# EAGLE board A500_GRAKA_26 (EAGLE 6.6.0), part 1 of 2
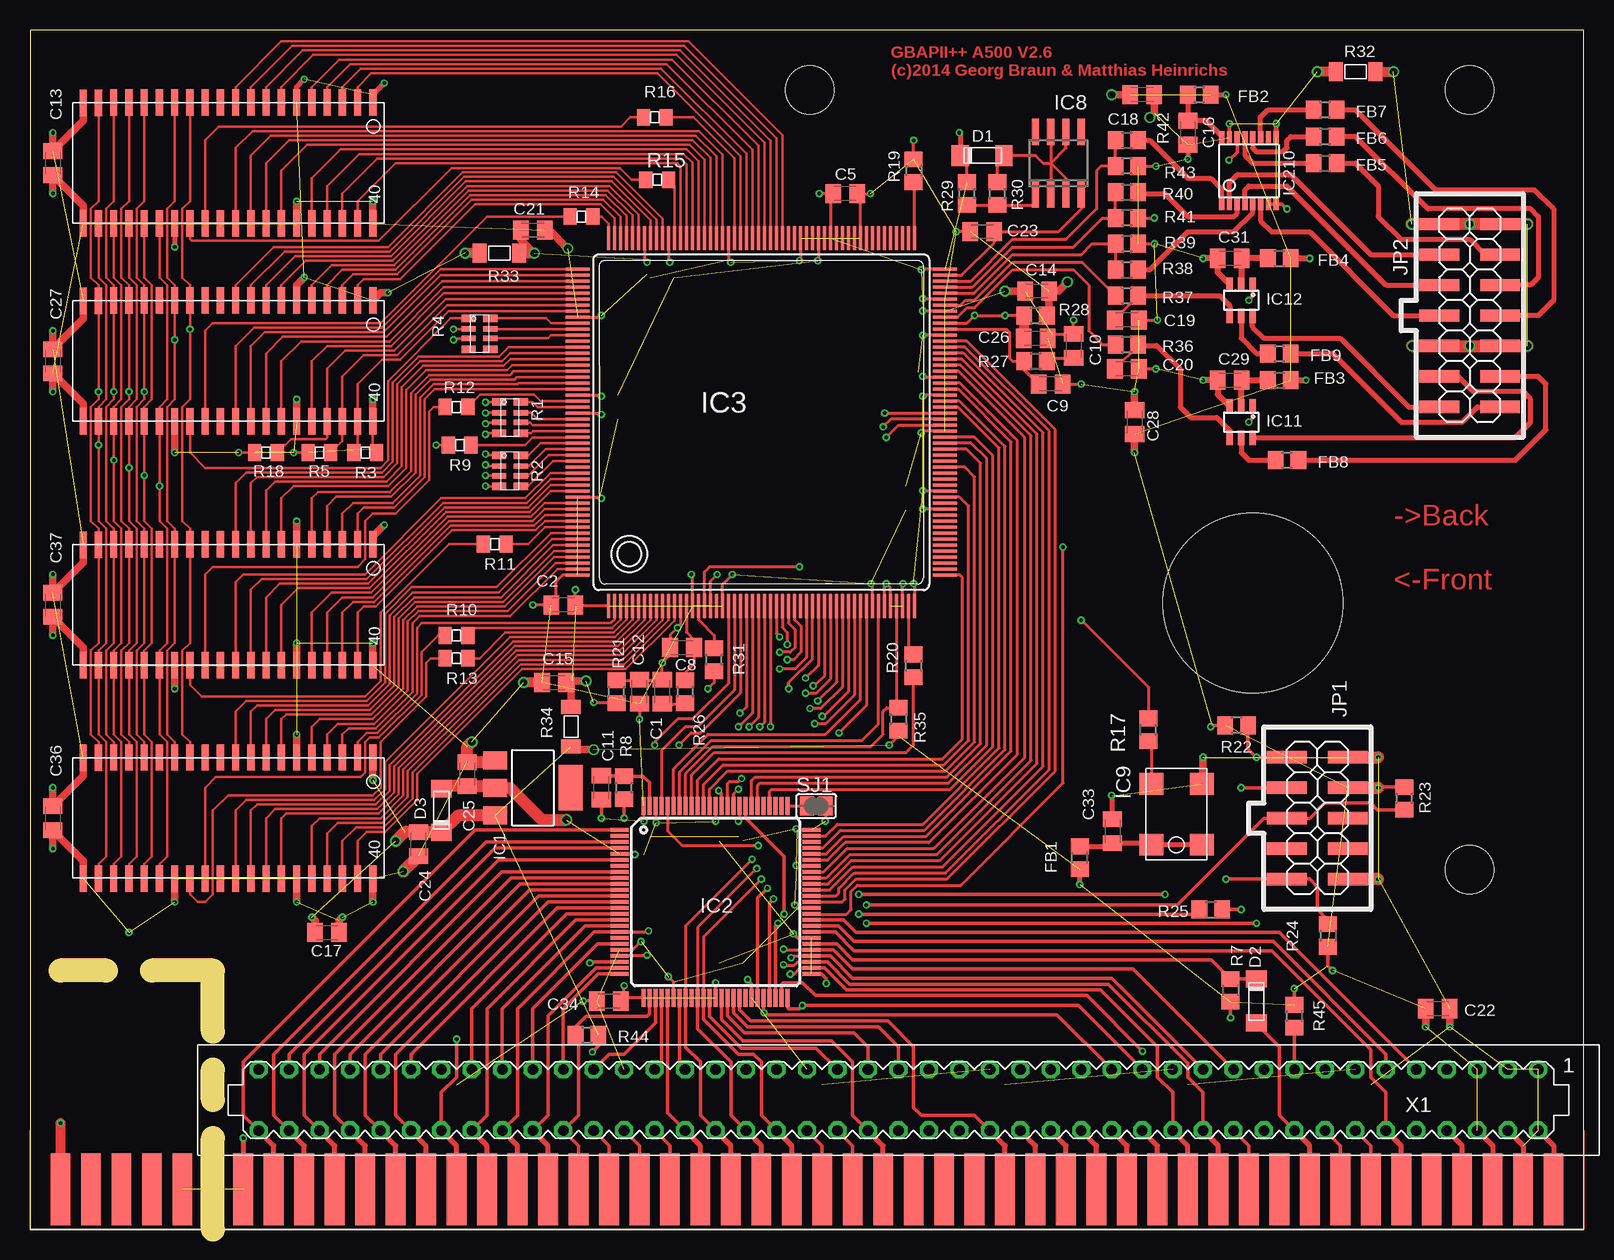
[diagram p2: board, top side]
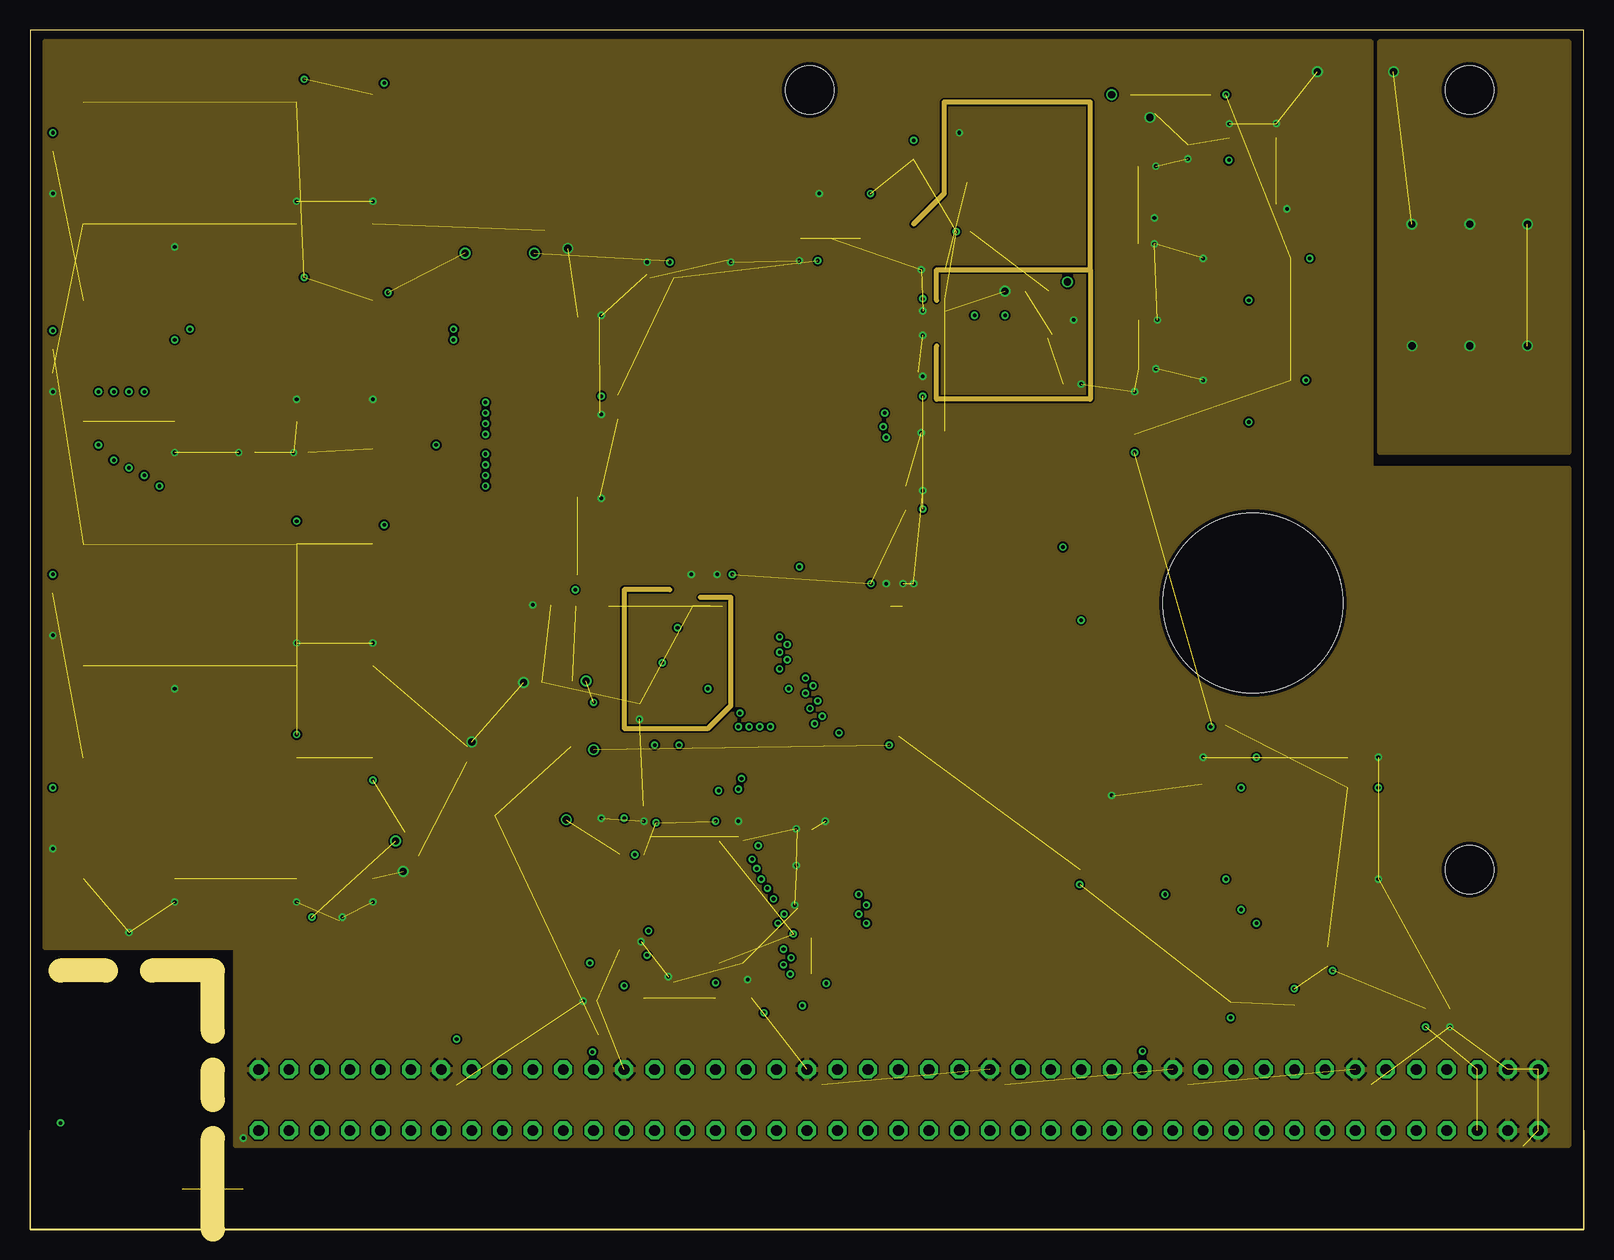
[diagram p3: board, inner layer Route2]
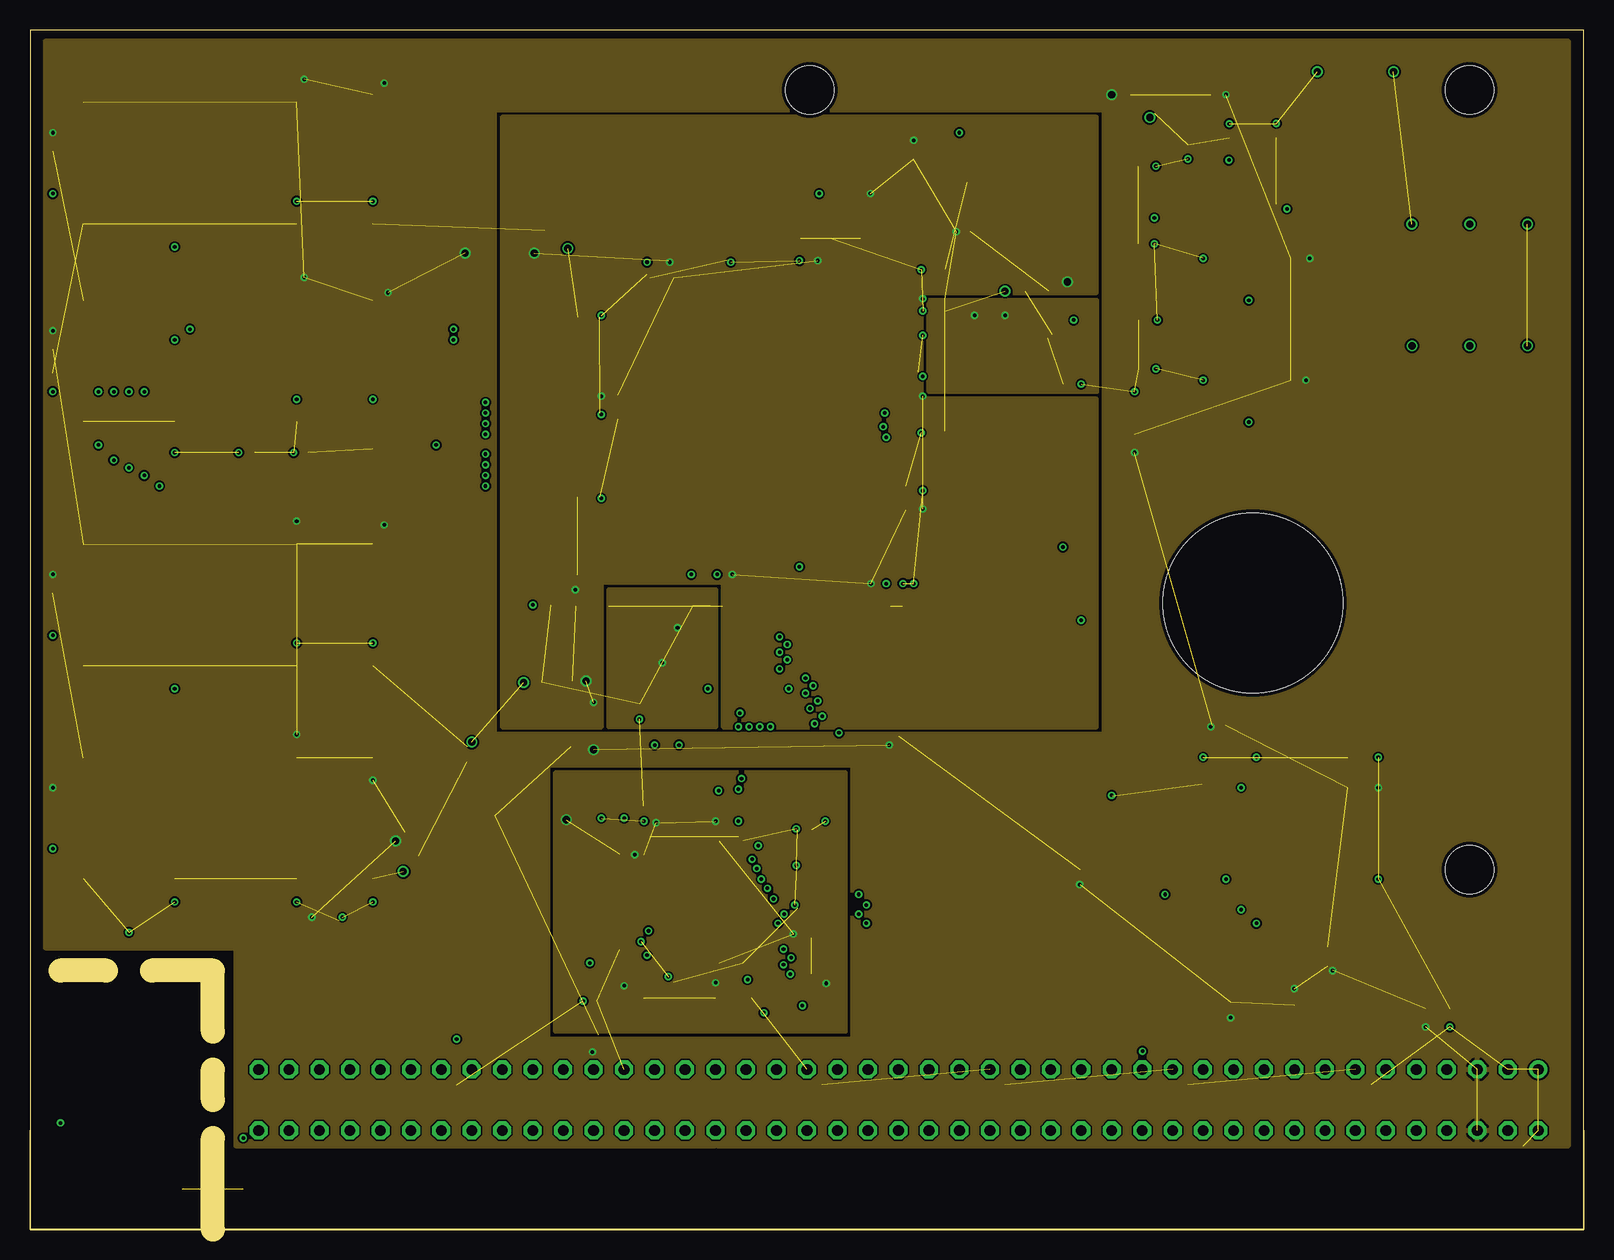
[diagram p4: board, inner layer Route15]
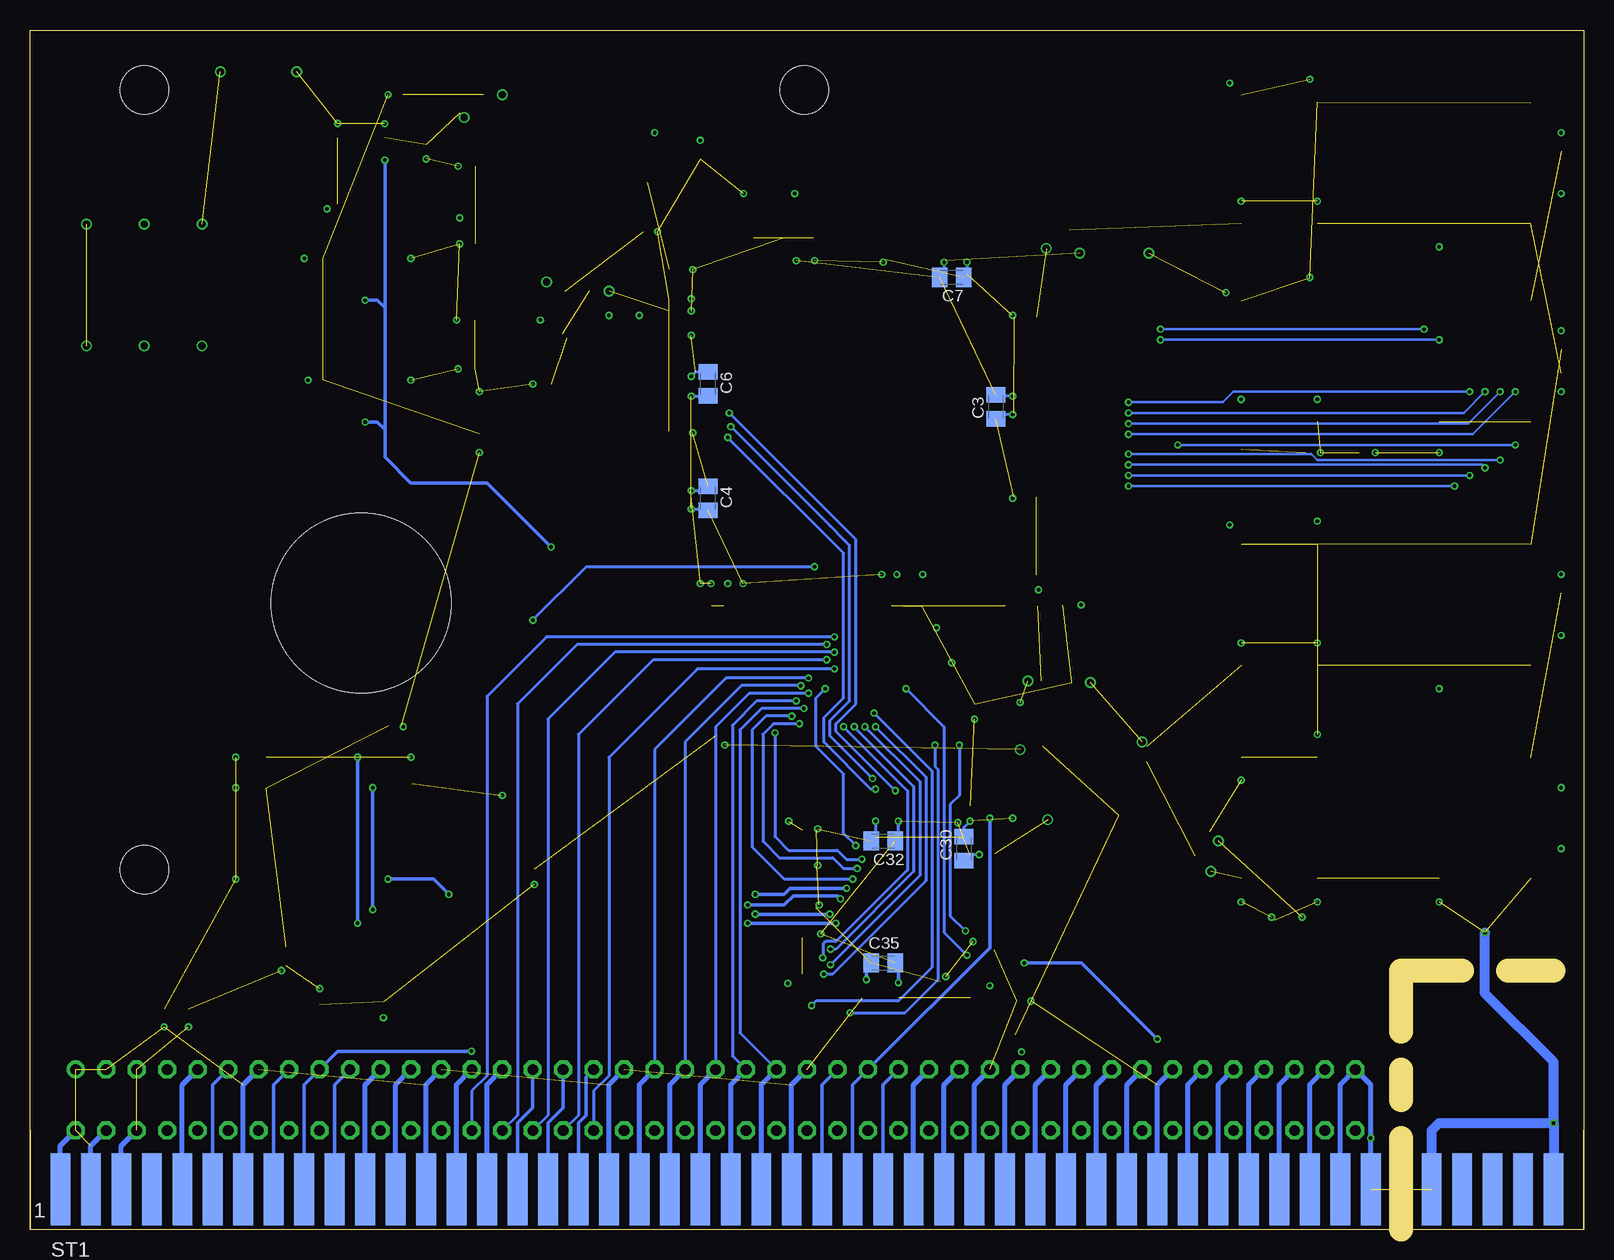
[diagram p5: board, bottom side, seen from below]

Size 129.54 x 100 mm. Coordinates in mm from the lower left corner, seen from the top.
Outline: 0,0 129.52,0 129.52,24.13 129.54,24.13 129.52,100 0,100 0,0
Copper layers (1+2*15+16): Top 0.035mm / dielectric 0.36mm / Route2 0.035mm / dielectric 0.71mm / Route15 0.035mm / dielectric 0.36mm / Bottom 0.035mm
Design rules "LeitOn - Standard-Eagle-DRU - 4-Lagen Multilayer - deutsch - Rev 2.0": minimum track width 0.15mm, minimum drill 0.3mm, track to track 0.15mm, track to pad 0.15mm, pad to pad 0.15mm, via to via 0.15mm, smd to smd 0.15mm, copper to edge 0.3mm, drill to drill 0.3mm, minimum pad ring 0.15mm, minimum via ring 0.15mm, stop-mask expansion 0.075mm, vias tented up to drill 0mil, thermal gap 0.2mm
Holes 4 mm at 120,30 65,95 120,95
Holes 15 mm at 101.93,52.22
tRestrict: area 61,91 to 69,99; area 116,91 to 124,99; area 116,26 to 124,34
bRestrict: area 61,91 to 69,99; area 116,91 to 124,99; area 116,26 to 124,34
Milling: 5 lines

## Footprints (pad centres in the part's own frame; a part is rotated, then mirrored left to right if it is on the bottom)
C0805K = smd 1.3 x 1.6: 1 -1,0; 2 1,0
SOD-80 = smd 1.429 x 1.746: 1 1.826,-0.002; 2 -1.832,0
R0805 = smd 1.3 x 1.5: 1 -0.95,0; 2 0.95,0
SOT223 = smd 1.499 x 2.007: 1 -2.261,-3.15; 2 0.025,-3.15; 3 2.311,-3.15 | smd 3.81 x 2.007: 4 0,3.15
TQ100 = smd 1.524 x 0.343: 1 -4.19,3.46; 2 -4.19,2.96; 3 -4.19,2.46; 4 -4.19,1.96; 5 -4.19,1.46; 6 -4.19,0.96; 7 -4.19,0.46; 8 -4.19,-0.04; 9 -4.19,-0.54; 10 -4.19,-1.04; 11 -4.19,-1.54; 13 -4.19,-2.54; 14 -4.19,-3.04; 15 -4.19,-3.54; 16 -4.19,-4.04; 17 -4.19,-4.54; 18 -4.19,-5.04; 19 -4.19,-5.54; 20 -4.19,-6.04; 21 -4.19,-6.54; 22 -4.19,-7.04; 23 -4.19,-7.54; 24 -4.19,-8.04; 25 -4.19,-8.54; 51 11.81,-8.54; 52 11.81,-8.04; 53 11.81,-7.54; 54 11.81,-7.04; 55 11.81,-6.54; 56 11.81,-6.04; 57 11.81,-5.54; 58 11.81,-5.04; 59 11.81,-4.54; 60 11.81,-4.04; 61 11.81,-3.54; 62 11.81,-3.04; 63 11.81,-2.54; 64 11.81,-2.04; 65 11.81,-1.54; 66 11.81,-1.04; 67 11.81,-0.54; 68 11.81,-0.04; 69 11.81,0.46; 70 11.81,0.96; 71 11.81,1.46; 72 11.81,1.96; 73 11.81,2.46; 74 11.81,2.96; 75 11.81,3.46 | smd 1.5 x 0.35: 12 -4.19,-2.04 | smd 0.343 x 1.524: 26 -2.19,-10.54; 27 -1.69,-10.54; 28 -1.19,-10.54; 29 -0.69,-10.54; 30 -0.19,-10.54; 31 0.31,-10.54; 32 0.81,-10.54; 33 1.31,-10.54; 34 1.81,-10.54; 35 2.31,-10.54; 36 2.81,-10.54; 37 3.31,-10.54; 38 3.81,-10.54; 39 4.31,-10.54; 40 4.81,-10.54; 41 5.31,-10.54; 42 5.81,-10.54; 43 6.31,-10.54; 44 6.81,-10.54; 45 7.31,-10.54; 46 7.81,-10.54; 47 8.31,-10.54; 48 8.81,-10.54; 49 9.31,-10.54; 50 9.81,-10.54; 76 9.81,5.46; 77 9.31,5.46; 78 8.81,5.46; 79 8.31,5.46; 80 7.81,5.46; 81 7.31,5.46; 82 6.81,5.46; 83 6.31,5.46; 84 5.81,5.46; 85 5.31,5.46; 86 4.81,5.46; 87 4.31,5.46; 88 3.81,5.46; 89 3.31,5.46; 90 2.81,5.46; 91 2.31,5.46; 92 1.81,5.46; 93 1.31,5.46; 94 0.81,5.46; 95 0.31,5.46; 96 -0.19,5.46; 97 -0.69,5.46; 98 -1.19,5.46; 99 -1.69,5.46; 100 -2.19,5.46
PQFP-208@3 = smd 0.25 x 2: 1 -12.75,-15.326; 2 -12.25,-15.326; 3 -11.75,-15.326; 4 -11.25,-15.326; 5 -10.75,-15.326; 6 -10.25,-15.326; 7 -9.75,-15.326; 8 -9.25,-15.326; 9 -8.75,-15.326; 10 -8.25,-15.326; 11 -7.75,-15.326; 12 -7.25,-15.326; 13 -6.75,-15.326; 14 -6.25,-15.326; 15 -5.75,-15.326; 16 -5.25,-15.326; 17 -4.75,-15.326; 18 -4.25,-15.326; 19 -3.75,-15.326; 20 -3.25,-15.326; 21 -2.75,-15.326; 22 -2.25,-15.326; 23 -1.75,-15.326; 24 -1.25,-15.326; 25 -0.75,-15.326; 26 -0.25,-15.326; 27 0.25,-15.326; 28 0.75,-15.326; 29 1.25,-15.326; 30 1.75,-15.326; 31 2.25,-15.326; 32 2.75,-15.326; 33 3.25,-15.326; 34 3.75,-15.326; 35 4.25,-15.326; 36 4.75,-15.326; 37 5.25,-15.326; 38 5.75,-15.326; 39 6.25,-15.326; 40 6.75,-15.326; 41 7.25,-15.326; 42 7.75,-15.326; 43 8.25,-15.326; 44 8.75,-15.326; 45 9.25,-15.326; 46 9.75,-15.326; 47 10.25,-15.326; 48 10.75,-15.326; 49 11.25,-15.326; 50 11.75,-15.326; 51 12.25,-15.326; 52 12.75,-15.326; 105 12.75,15.326; 106 12.25,15.326; 107 11.75,15.326; 108 11.25,15.326; 109 10.75,15.326; 110 10.25,15.326; 111 9.75,15.326; 112 9.25,15.326; 113 8.75,15.326; 114 8.25,15.326; 115 7.75,15.326; 116 7.25,15.326; 117 6.75,15.326; 118 6.25,15.326; 119 5.75,15.326; 120 5.25,15.326; 121 4.75,15.326; 122 4.25,15.326; 123 3.75,15.326; 124 3.25,15.326; 125 2.75,15.326; 126 2.25,15.326; 127 1.75,15.326; 128 1.25,15.326; 129 0.75,15.326; 130 0.25,15.326; 131 -0.25,15.326; 132 -0.75,15.326; 133 -1.25,15.326; 134 -1.75,15.326; 135 -2.25,15.326; 136 -2.75,15.326; 137 -3.25,15.326; 138 -3.75,15.326; 139 -4.25,15.326; 140 -4.75,15.326; 141 -5.25,15.326; 142 -5.75,15.326; 143 -6.25,15.326; 144 -6.75,15.326; 145 -7.25,15.326; 146 -7.75,15.326; 147 -8.25,15.326; 148 -8.75,15.326; 149 -9.25,15.326; 150 -9.75,15.326; 151 -10.25,15.326; 152 -10.75,15.326; 153 -11.25,15.326; 154 -11.75,15.326; 155 -12.25,15.326; 156 -12.75,15.326 | smd 2 x 0.25: 53 15.326,-12.75; 54 15.326,-12.25; 55 15.326,-11.75; 56 15.326,-11.25; 57 15.326,-10.75; 58 15.326,-10.25; 59 15.326,-9.75; 60 15.326,-9.25; 61 15.326,-8.75; 62 15.326,-8.25; 63 15.326,-7.75; 64 15.326,-7.25; 65 15.326,-6.75; 66 15.326,-6.25; 67 15.326,-5.75; 68 15.326,-5.25; 69 15.326,-4.75; 70 15.326,-4.25; 71 15.326,-3.75; 72 15.326,-3.25; 73 15.326,-2.75; 74 15.326,-2.25; 75 15.326,-1.75; 76 15.326,-1.25; 77 15.326,-0.75; 78 15.326,-0.25; 79 15.326,0.25; 80 15.326,0.75; 81 15.326,1.25; 82 15.326,1.75; 83 15.326,2.25; 84 15.326,2.75; 85 15.326,3.25; 86 15.326,3.75; 87 15.326,4.25; 88 15.326,4.75; 89 15.326,5.25; 90 15.326,5.75; 91 15.326,6.25; 92 15.326,6.75; 93 15.326,7.25; 94 15.326,7.75; 95 15.326,8.25; 96 15.326,8.75; 97 15.326,9.25; 98 15.326,9.75; 99 15.326,10.25; 100 15.326,10.75; 101 15.326,11.25; 102 15.326,11.75; 103 15.326,12.25; 104 15.326,12.75; 157 -15.326,12.75; 158 -15.326,12.25; 159 -15.326,11.75; 160 -15.326,11.25; 161 -15.326,10.75; 162 -15.326,10.25; 163 -15.326,9.75; 164 -15.326,9.25; 165 -15.326,8.75; 166 -15.326,8.25; 167 -15.326,7.75; 168 -15.326,7.25; 169 -15.326,6.75; 170 -15.326,6.25; 171 -15.326,5.75; 172 -15.326,5.25; 173 -15.326,4.75; 174 -15.326,4.25; 175 -15.326,3.75; 176 -15.326,3.25; 177 -15.326,2.75; 178 -15.326,2.25; 179 -15.326,1.75; 180 -15.326,1.25; 181 -15.326,0.75; 182 -15.326,0.25; 183 -15.326,-0.25; 184 -15.326,-0.75; 185 -15.326,-1.25; 186 -15.326,-1.75; 187 -15.326,-2.25; 188 -15.326,-2.75; 189 -15.326,-3.25; 190 -15.326,-3.75; 191 -15.326,-4.25; 192 -15.326,-4.75; 193 -15.326,-5.25; 194 -15.326,-5.75; 195 -15.326,-6.25; 196 -15.326,-6.75; 197 -15.326,-7.25; 198 -15.326,-7.75; 199 -15.326,-8.25; 200 -15.326,-8.75; 201 -15.326,-9.25; 202 -15.326,-9.75; 203 -15.326,-10.25; 204 -15.326,-10.75; 205 -15.326,-11.25; 206 -15.326,-11.75; 207 -15.326,-12.25; 208 -15.326,-12.75
SOJ40/4 = smd 0.6 x 2.2: 1 -10.795,-5.061; 2 -9.525,-5.061; 3 -8.255,-5.061; 4 -6.985,-5.061; 5 -5.715,-5.061; 6 -4.445,-5.061; 7 -3.175,-5.061; 8 -1.905,-5.061; 9 -0.635,-5.061; 10 0.635,-5.061; 11 1.905,-5.061; 12 3.175,-5.061; 13 4.445,-5.061; 14 5.715,-5.061; 15 6.985,-5.061; 16 8.255,-5.061; 17 9.525,-5.061; 18 10.795,-5.061; 19 12.065,-5.029; 20 13.335,-5.029; 21 13.335,5.029; 22 12.065,5.029; 23 10.795,5.029; 24 9.525,5.029; 25 8.255,5.029; 26 6.985,5.029; 27 5.715,5.029; 28 4.445,5.029; 29 3.175,5.029; 30 1.905,5.029; 31 0.635,5.029; 32 -0.635,5.029; 33 -1.905,5.029; 34 -3.175,5.029; 35 -4.445,5.029; 36 -5.715,5.029; 37 -6.985,5.029; 38 -8.255,5.029; 39 -9.525,5.029; 40 -10.795,5.029
SO08 = smd 0.6 x 2.2: 1 -1.905,-2.6; 2 -0.635,-2.6; 3 0.635,-2.6; 4 1.905,-2.6; 5 1.905,2.6; 6 0.635,2.6; 7 -0.635,2.6; 8 -1.905,2.6
7X5 = smd 1.8 x 2: P$1 -2.54,-2.1; P$2 2.54,-2.1; P$3 2.54,2.1; P$4 -2.54,2.1
SOT23-6L = smd 0.55 x 1.2: 1 -0.95,-1.3; 2 0,-1.3; 3 0.95,-1.3; 4 0.95,1.3; 5 0,1.3; 6 -0.95,1.3
TSSOP16 = smd 0.45 x 1.05: 1 -2.275,-2.768; 2 -1.625,-2.768; 3 -0.975,-2.768; 4 -0.325,-2.768; 5 0.325,-2.768; 6 0.975,-2.768; 7 1.625,-2.768; 8 2.275,-2.768; 9 2.275,2.768; 10 1.625,2.768; 11 0.975,2.768; 12 0.325,2.768; 13 -0.325,2.768; 14 -0.975,2.768; 15 -1.625,2.768; 16 -2.275,2.768
2X05SMD = smd 1.016 x 3.302: 1 -1.27,-3.81; 2 -1.27,1.27; 3 1.27,-3.81; 4 1.27,1.27; 5 3.81,-3.81; 6 3.81,1.27; 7 6.35,-3.81; 8 6.35,1.27; 9 8.89,-3.81; 10 8.89,1.27
2X07SMD = smd 1.016 x 3.302: 1 -1.27,-3.81; 2 -1.27,1.27; 3 1.27,-3.81; 4 1.27,1.27; 5 3.81,-3.81; 6 3.81,1.27; 7 6.35,-3.81; 8 6.35,1.27; 9 8.89,-3.81; 10 8.89,1.27; 11 11.43,-3.81; 12 11.43,1.27; 13 13.97,-3.81; 14 13.97,1.27
R-NETZ = smd 0.63 x 1.2: P$1 -1.3,-0.9; P$4 1.3,-0.9; P$5 1.3,0.9; P$8 -1.3,0.9 | smd 0.45 x 1.2: P$2 -0.4,-0.9; P$3 0.4,-0.9; P$6 0.4,0.9; P$7 -0.4,0.9
0805@2 = smd 1.092 x 1.397: 1 -0.94,0; 2 0.94,0
0204 = smd 1.16 x 1.6: 1 -1.651,0; 2 1.651,0
SJ = smd 1.168 x 1.6: 1 -0.762,0; 2 0.762,0
LKOT-501 = smd 1.65 x 6: 1 -62.23,-0.953; 3 -59.69,-0.953; 5 -57.15,-0.953; 7 -54.61,-0.953; 9 -52.07,-0.953; 11 -49.53,-0.953; 13 -46.99,-0.953; 15 -44.45,-0.953; 17 -41.91,-0.953; 19 -39.37,-0.953; 21 -36.83,-0.953; 23 -34.29,-0.953; 25 -31.75,-0.953; 27 -29.21,-0.953; 29 -26.67,-0.953; 31 -24.13,-0.953; 33 -21.59,-0.953; 35 -19.05,-0.953; 37 -16.51,-0.953; 39 -13.97,-0.953; 41 -11.43,-0.953; 43 -8.89,-0.953; 45 -6.35,-0.953; 47 -3.81,-0.953; 49 -1.27,-0.953; 51 1.27,-0.953; 53 3.81,-0.953; 55 6.35,-0.953; 57 8.89,-0.953; 59 11.43,-0.953; 61 13.97,-0.953; 63 16.51,-0.953; 65 19.05,-0.953; 67 21.59,-0.953; 69 24.13,-0.953; 71 26.67,-0.953; 73 29.21,-0.953; 75 31.75,-0.953; 77 34.29,-0.953; 79 36.83,-0.953; 81 39.37,-0.953; 83 41.91,-0.953; 85 44.45,-0.953; 87 46.99,-0.953; 89 49.53,-0.953; 91 52.07,-0.953; 93 54.61,-0.953; 95 57.15,-0.953; 97 59.69,-0.953; 99 62.23,-0.953 | smd 1.65 x 6 bottom: 2 -62.23,-0.953; 4 -59.69,-0.953; 6 -57.15,-0.953; 8 -54.61,-0.953; 10 -52.07,-0.953; 12 -49.53,-0.953; 14 -46.99,-0.953; 16 -44.45,-0.953; 18 -41.91,-0.953; 20 -39.37,-0.953; 22 -36.83,-0.953; 24 -34.29,-0.953; 26 -31.75,-0.953; 28 -29.21,-0.953; 30 -26.67,-0.953; 32 -24.13,-0.953; 34 -21.59,-0.953; 36 -19.05,-0.953; 38 -16.51,-0.953; 40 -13.97,-0.953; 42 -11.43,-0.953; 44 -8.89,-0.953; 46 -6.35,-0.953; 48 -3.81,-0.953; 50 -1.27,-0.953; 52 1.27,-0.953; 54 3.81,-0.953; 56 6.35,-0.953; 58 8.89,-0.953; 60 11.43,-0.953; 62 13.97,-0.953; 64 16.51,-0.953; 66 19.05,-0.953; 68 21.59,-0.953; 70 24.13,-0.953; 72 26.67,-0.953; 74 29.21,-0.953; 76 31.75,-0.953; 78 34.29,-0.953; 80 36.83,-0.953; 82 39.37,-0.953; 84 41.91,-0.953; 86 44.45,-0.953; 88 46.99,-0.953; 90 49.53,-0.953; 92 52.07,-0.953; 94 54.61,-0.953; 96 57.15,-0.953; 98 59.69,-0.953; 100 62.23,-0.953
SLOT-86 = drill 0.9 pad 1.5: 1 -53.34,-2.54 | drill 0.9 pad 1.5 octagon: 2 -53.34,2.54; 3 -50.8,-2.54; 4 -50.8,2.54; 5 -48.26,-2.54; 6 -48.26,2.54; 7 -45.72,-2.54; 8 -45.72,2.54; 9 -43.18,-2.54; 10 -43.18,2.54; 11 -40.64,-2.54; 12 -40.64,2.54; 13 -38.1,-2.54; 14 -38.1,2.54; 15 -35.56,-2.54; 16 -35.56,2.54; 17 -33.02,-2.54; 18 -33.02,2.54; 19 -30.48,-2.54; 20 -30.48,2.54; 21 -27.94,-2.54; 22 -27.94,2.54; 23 -25.4,-2.54; 24 -25.4,2.54; 25 -22.86,-2.54; 26 -22.86,2.54; 27 -20.32,-2.54; 28 -20.32,2.54; 29 -17.78,-2.54; 30 -17.78,2.54; 31 -15.24,-2.54; 32 -15.24,2.54; 33 -12.7,-2.54; 34 -12.7,2.54; 35 -10.16,-2.54; 36 -10.16,2.54; 37 -7.62,-2.54; 38 -7.62,2.54; 39 -5.08,-2.54; 40 -5.08,2.54; 41 -2.54,-2.54; 42 -2.54,2.54; 43 0,-2.54; 44 0,2.54; 45 2.54,-2.54; 46 2.54,2.54; 47 5.08,-2.54; 48 5.08,2.54; 49 7.62,-2.54; 50 7.62,2.54; 51 10.16,-2.54; 52 10.16,2.54; 53 12.7,-2.54; 54 12.7,2.54; 55 15.24,-2.54; 56 15.24,2.54; 57 17.78,-2.54; 58 17.78,2.54; 59 20.32,-2.54; 60 20.32,2.54; 61 22.86,-2.54; 62 22.86,2.54; 63 25.4,-2.54; 64 25.4,2.54; 65 27.94,-2.54; 66 27.94,2.54; 67 30.48,-2.54; 68 30.48,2.54; 69 33.02,-2.54; 70 33.02,2.54; 71 35.56,-2.54; 72 35.56,2.54; 73 38.1,-2.54; 74 38.1,2.54; 75 40.64,-2.54; 76 40.64,2.54; 77 43.18,-2.54; 78 43.18,2.54; 79 45.72,-2.54; 80 45.72,2.54; 81 48.26,-2.54; 82 48.26,2.54; 83 50.8,-2.54; 84 50.8,2.54; 85 53.34,-2.54; 86 53.34,2.54

## Placement (x,y rotation side)
C1  2,2uF  [C0805K]  52.71,44.83 270 top
C2  100nF  [C0805K]  44.45,52.07 0 top
C3  100nF  [C0805K]  49.02,68.58 90 bottom
C4  100nF  [C0805K]  73.03,60.96 270 bottom
C5  100nF  [C0805K]  67.95,86.36 0 top
C6  100nF  [C0805K]  73.03,70.48 270 bottom
C7  100nF  [C0805K]  52.71,79.38 180 bottom
C8  100nF  [C0805K]  54.36,48.51 0 top
C9  100nF  [C0805K]  85.09,70.48 0 top
C10  2,2uF  [C0805K]  87,73.66 90 top
C11  n.b.  [C0805K]  47.63,36.83 90 top
C12  10uF  [C0805K]  50.8,44.83 90 top
C13  100nF  [C0805K]  1.91,88.9 270 top
C14  10uF  [C0805K]  83.95,78.23 180 top
C15  10uF  [C0805K]  43.69,45.59 0 top
C16  100nF  [C0805K]  96.52,91.44 270 top
C17  10uF  [C0805K]  24.77,24.77 180 top
C18  10uF  [C0805K]  92.71,94.61 180 top
C19  n.b.  [C0805K]  91.44,75.82 0 top
C20  n.b.  [C0805K]  91.44,71.75 0 top
C21  10uF  [C0805K]  41.91,83.31 180 top
C22  10uF  [C0805K]  117.35,18.41 180 top
C23  2,2uF  [C0805K]  79.38,83.19 0 top
C24  10uF  [C0805K]  32.39,32.13 90 top
C25  10uF  [C0805K]  36.45,37.97 270 top
C26  10uF  [C0805K]  83.82,74.3 0 top
C27  100nF  [C0805K]  1.91,72.39 270 top
C28  10uF  [C0805K]  92.08,67.31 270 top
C29  100nF  [C0805K]  100.01,70.8 180 top
C30  100nF  [C0805K]  51.69,31.75 90 bottom
C31  100nF  [C0805K]  100.01,80.96 180 top
C32  100nF  [C0805K]  58.42,32.38 180 bottom
C33  100nF  [C0805K]  90.23,33.21 90 top
C34  100nF  [C0805K]  48.26,19.05 180 top
C35  100nF  [C0805K]  58.42,22.23 180 bottom
C36  100nF  [C0805K]  1.91,34.29 270 top
C37  100nF  [C0805K]  1.91,52.07 270 top
D1  BAS32L  [SOD-80]  79.38,89.53 0 top
D2  BAS32L  [SOD-80]  102.24,19.05 270 top
D3  BAS32L  [SOD-80]  34.29,34.92 90 top
FB1  [R0805]  87.5,30.99 90 top
FB2  [R0805]  97.47,94.61 0 top
FB3  [R0805]  104.14,70.8 0 top
FB4  [R0805]  104.14,80.96 0 top
FB5  [R0805]  107.95,88.9 0 top
FB6  [R0805]  107.95,91.12 0 top
FB7  [R0805]  107.95,93.34 0 top
FB8  10R  [R0805]  104.78,64.14 0 top
FB9  10R  [R0805]  104.14,73.03 0 top
IC1  REG1117  [SOT223]  41.91,36.83 270 top
IC2  XC95144XLTQ100  [TQ100]  53.34,29.84 0 top
IC3  GD5434  [PQFP-208@3]  60.96,67.31 0 top
IC4  514260  [SOJ40/4]  17.78,34.29 180 top
IC5  514260  [SOJ40/4]  17.78,88.9 180 top
IC6  514260  [SOJ40/4]  17.78,52.07 180 top
IC7  514260  [SOJ40/4]  17.78,72.39 180 top
IC8  LM334  [SO08]  85.73,88.9 0 top
IC9  14.31818MHz  [7X5]  95.57,34.61 90 top
IC11  STG719  [SOT23-6L]  100.97,67.31 180 top
IC12  STG719  [SOT23-6L]  100.97,77.47 180 top
IC210  STAV340  [TSSOP16]  101.6,88.27 0 top
JP1  [2X05SMD]  108.59,38.1 270 top
JP2  [2X07SMD]  121.29,82.55 270 top
R1  22R  [R-NETZ]  40.01,67.69 270 top
R2  22R  [R-NETZ]  40.01,63.25 270 top
R3  6.8K  [0805@2]  27.94,64.77 0 top
R4  22R  [R-NETZ]  37.47,74.68 270 top
R5  n.b.  [0805@2]  24.13,64.77 180 top
R7  1k  [R0805]  100.08,19.94 270 top
R8  1R  [R0805]  49.53,36.83 90 top
R9  22R  [0805@2]  35.81,65.41 0 top
R10  22R  [0805@2]  35.56,49.53 0 top
R11  22R  [0805@2]  38.74,57.15 0 top
R12  22R  [0805@2]  35.56,68.58 180 top
R13  22R  [0805@2]  35.56,47.62 0 top
R14  22R  [0805@2]  45.97,84.45 0 top
R15  22R  [0805@2]  52.27,87.5 0 top
R16  22R  [0805@2]  52.07,92.71 0 top
R17  75R  [R0805]  93.22,41.66 90 top
R18  6.8K  [0805@2]  19.69,64.77 180 top
R19  10k  [R0805]  73.66,88.27 270 top
R20  100R  [R0805]  73.66,46.99 90 top
R21  33R  [R0805]  48.9,44.83 90 top
R22  10k  [R0805]  100.58,42.04 180 top
R23  10k  [R0805]  114.55,35.94 90 top
R24  10k  [R0805]  108.2,24.51 270 top
R25  10R  [R0805]  98.43,26.67 0 top
R26  75R  [R0805]  54.61,44.83 270 top
R27  75R  [R0805]  83.82,72.39 0 top
R28  33R  [R0805]  83.82,76.2 0 top
R29  150R  [R0805]  78.11,86.36 90 top
R30  22R  [R0805]  80.65,86.36 90 top
R31  33R  [R0805]  57.02,47.5 90 top
R32  1R  [0204]  110.49,96.52 180 top
R33  1R  [0204]  39.12,81.41 180 top
R34  1R  [0204]  45.09,41.91 270 top
R35  1k  [R0805]  72.39,42.55 270 top
R36  10R  [R0805]  91.44,73.79 0 top
R37  10R  [R0805]  91.44,77.85 0 top
R38  1R  [R0805]  91.44,80.01 0 top
R39  75R  [R0805]  91.44,82.17 180 top
R40  1R  [R0805]  91.44,86.49 0 top
R41  75R  [R0805]  91.44,84.33 180 top
R42  1R  [R0805]  91.44,90.81 0 top
R43  75R  [R0805]  91.44,88.65 180 top
R44  10k  [R0805]  46.43,16.23 0 top
R45  10k  [R0805]  105.41,17.78 90 top
SJ1  [SJ]  65.53,35.31 0 top
ST1  SL50-2  [LKOT-501]  64.77,4.32 0 bottom
X1  SLOT-86  [SLOT-86]  72.39,10.79 180 top